# Altium project MC3_r2.PrjPcb (part 8 of 10)

## Sheet PowerSupply.SchDoc
size Letter; Organization: Altium Limited; Address1: L3, 12a Rodborough Rd; Address2: Frenchs Forest; Address3: NSW; Address4: Australia 2086; DocumentNumber: D_6; SheetNumber: 6; SheetTotal: 21
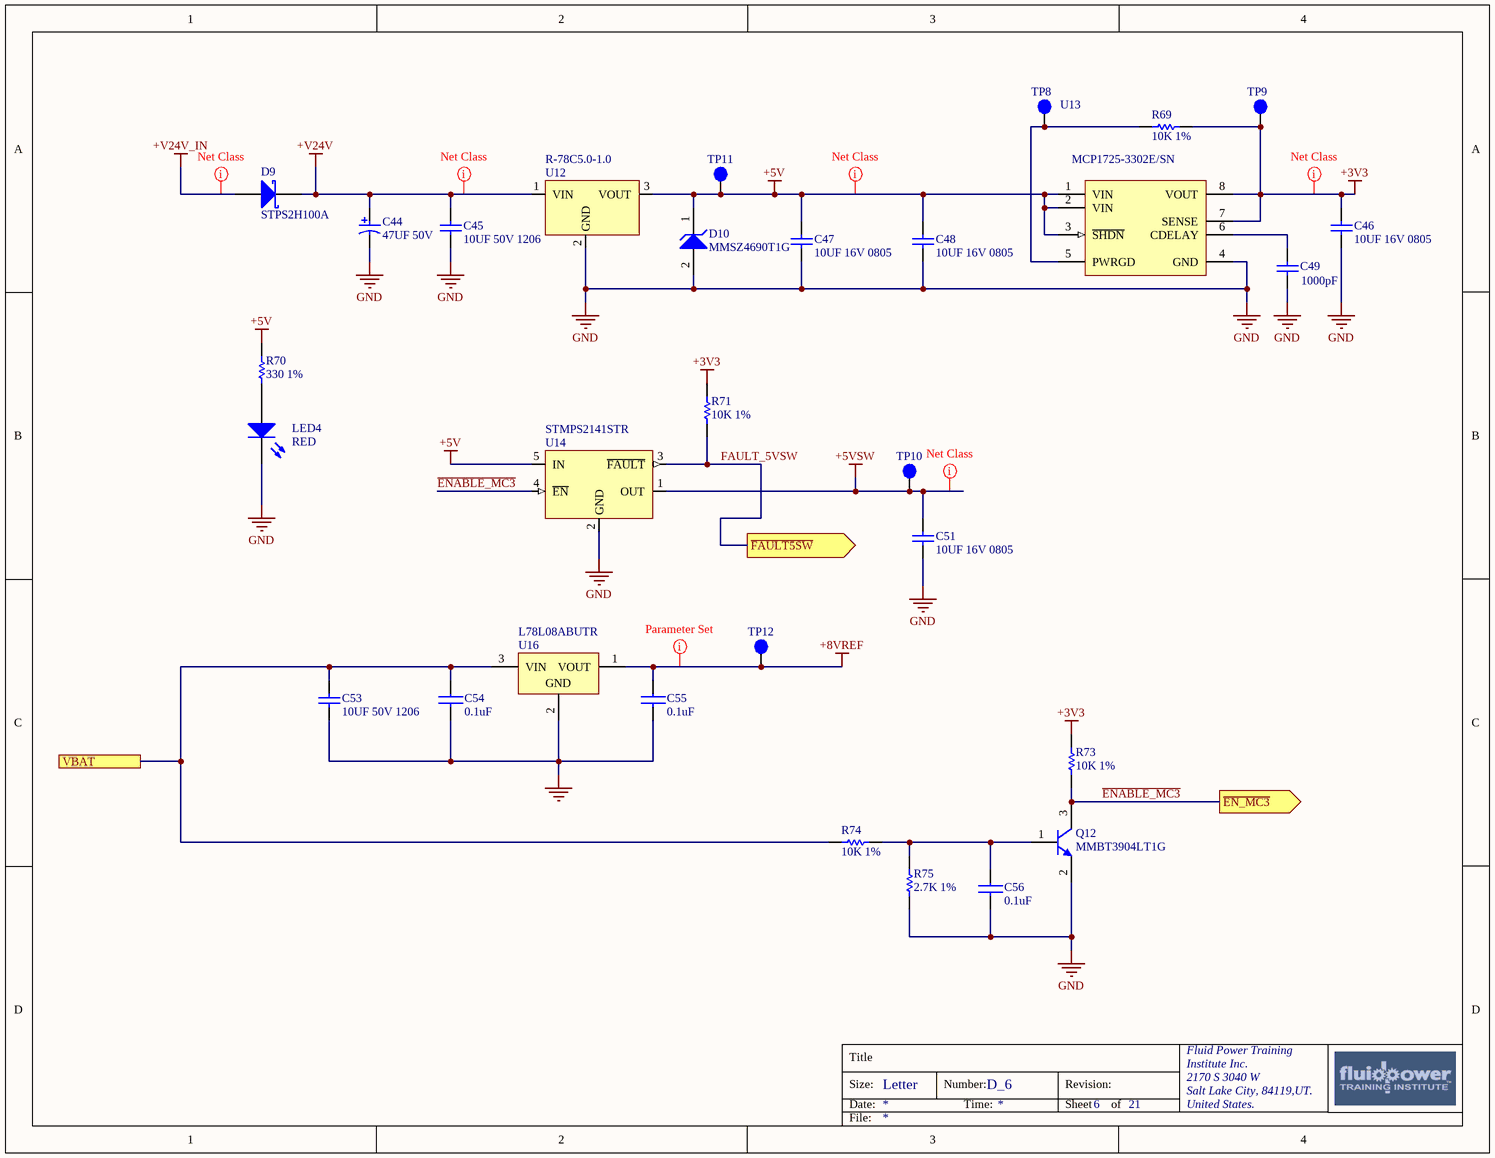
[diagram p14: PowerSupply.SchDoc]

### Parts
C44  47UF 50V  [PNSC-EEE-HA1H470XP-2_V]
C45  10UF 50V 1206  [CAPC3216X180X20ML20]
C46  10UF 16V 0805  [CAPC2012X14M]
C47  10UF 16V 0805  [CAPC2012X14M]
C48  10UF 16V 0805  [CAPC2012X14M]
C49  1000pF  [C0805]
C51  10UF 16V 0805  [CAPC2012X14M]
C53  10UF 50V 1206  [CAPC3216X180X20ML20]
C54  0.1uF  [C0805]
C55  0.1uF  [C0805]
C56  0.1uF  [C0805]
D9  STPS2H100A  [STM-SMA-2_V]
D10  MMSZ4690T1G  [ONSC-SOD-123-2-425-04_V]
LED4  RED  [LED0805]
Q12  MMBT3904LT1G  [ONSC-SOT-23-3-318-08_V]
R69  10K 1%  [R0805]
R70  330 1%  [R0805]
R71  10K 1%  [R0805]
R73  10K 1%  [R0805]
R74  10K 1%  [R0805]
R75  2.7K 1%  [R0805]
TP8  T  [TESTPOINTSMD_1x1MM]  (value not drawn)  (no BOM)
TP9  T  [TESTPOINTSMD_1x1MM]  (value not drawn)  (no BOM)
TP10  T  [TESTPOINTSMD_1x1MM]  (value not drawn)  (no BOM)
TP11  T  [TESTPOINTSMD_1x1MM]  (value not drawn)  (no BOM)
TP12  T  [TESTPOINTSMD_1x1MM]  (value not drawn)  (no BOM)
U12  R-78C5.0-1.0  [SIP3]
U13  MCP1725-3302E/SN  [SOIC-SN8_M]
U14  STMPS2141STR  [SOT95P280X145-5M]
U16  L78L08ABUTR  [SOT-89_L]

### Ports
VBAT, ~{EN_MC3} (out), ~{FAULT5SW} (out)

### Nets
+3V3: C46.2 R69.2 R71.2 R73.2 TP9.1 U13.7(SENSE) U13.8(VOUT)
+5V: C47.2 C48.2 D10.1(K) R70.2 TP11.1 U12.3(VOUT) U13.1(VIN) U13.2(VIN) U13.3(~{SHDN}) U14.5(IN)
+5VSW: C51.2 TP10.1 U14.1(OUT)
+8VREF: C55.1 TP12.1 U16.1(VOUT)
+V24V: C44.1 C45.2 D9.2(K) U12.1(VIN)
+V24V_IN: D9.1(A)
GND: C44.2 C45.1 C46.1 C47.1 C48.1 C49.1 C51.1 C53.1 C54.2 C55.2 C56.2 D10.2(A) LED4.1(K) Q12.2(E) R75.1 U12.2(GND) U13.4(GND) U14.2(GND) U16.2(GND)
~{ENABLE_MC3}: Q12.3(C) R73.1 U14.4(~{EN}) ; port ~{EN_MC3}  [project net nMC3Power]
FAULT_5VSW: R71.1 U14.3(~{FAULT}) ; port ~{FAULT5SW}  [project net nFault5VSW]
VBATT_: C53.2 C54.1 R74.1 U16.3(VIN) ; port VBAT
NetC49_2: C49.2 U13.6(CDELAY)
NetC56_1: C56.1 Q12.1(B) R74.2 R75.2
NetLED4_2: LED4.2(A) R70.1
NetR69_1: R69.1 TP8.1 U13.5(PWRGD)

### Layout directives
net class POWER: +3V3, +5V, +5VSW, +V24V, +V24V_IN
net class VREF: +8VREF

### Notes on the sheet
- Title
- Size:
- Date:
- Letter
- Number:
- Time:
- Revision:
- Sheet
- of
- Fluid Power Training
- Institute Inc.
- 2170 S 3040 W
- Salt Lake City, 84119,UT.
- United States.
- File:

### Library data of the parts
C44 = EEE-HA1H470XP: EEE-HA Series 50 V 47 uF Ø 6.3 x 7.7 mm 105 °C SMT V-Chip Aluminum Electrolytic; Manufacturer: Panasonic; Ripple Current: 63mA; Tolerance: 20%; Life (Hours): 1000Hour; Leakage Current: 23.5uA; Polarity: Polar; Lead Diameter: 0.65mm; Supplier 1: Mouser; Supplier Part Number 1: 667-EEE-HA1H470XP; Manufacturer Part Number: EEE-HA1H470XP; RoHS: Yes; Category: Aluminum Electrolytic Capacitors; Stock 1: 2923; Pricing 1: 1=0.50000, 10=0.34700, 100=0.11500, 900=0.10900, 1800=0.09700, 9900=0.08900 (USD); Mount: Surface Mount,PCB; Case/Package: Radial; Number of Pins: 8; Contact Plating: Tin; Min Operating Temperature: -40°C; Max Operating Temperature: 105°C; Capacitance: 47uF; Voltage Rating (DC): 50V; Packaging: Tape and Reel; Package Quantity: 900; Voltage Rating: 50V; Termination: SMD/SMT; Voltage: 50V; Ripple Current (AC): 63mA; Diameter: 6.3mm; Length: 8mm; Height: 7.7mm; Height - Seated (Max): 0.303inch; Lead Pitch: 1.8mm; Width: 650um; Radiation Hardening: No; REACH SVHC: No SVHC; Lead Free: Lead Free; ComponentLink1URL: https://datasheet.ciiva.com/11777/0900766b8102e3f9-11777524.pdf?src-supplier=RSComponents; ComponentLink1Description: https://datasheet.ciiva.com/11777/0900766b8102e3f9-11777524.pdf?src-supplier=RSComponents; ComponentLink2URL: https://datasheet.ciiva.com/27052/1358776-27052072.pdf?src-supplier=Jameco; ComponentLink2Description: https://datasheet.ciiva.com/27052/1358776-27052072.pdf?src-supplier=Jameco; ComponentLink3URL: https://datasheet.ciiva.com/2983/aba0000ce3-2983989.pdf?src-supplier=Avnet; ComponentLink3Description: https://datasheet.ciiva.com/2983/aba0000ce3-2983989.pdf?src-supplier=Avnet; ComponentLink4URL: https://datasheet.ciiva.com/28691/1446029-28691286.pdf?src-supplier=Element14; ComponentLink4Description: https://datasheet.ciiva.com/28691/1446029-28691286.pdf?src-supplier=Element14; ComponentLink5URL: https://datasheet.ciiva.com/17536/aba0000ce3-17536201.pdf?src-supplier=Avnet+Europe; ComponentLink5Description: https://datasheet.ciiva.com/17536/aba0000ce3-17536201.pdf?src-supplier=Avnet+Europe; ComponentLink6URL: https://datasheet.ciiva.com/46387/1446029-46387354.pdf?src-supplier=Element14; ComponentLink6Description: https://datasheet.ciiva.com/46387/1446029-46387354.pdf?src-supplier=Element14; ComponentLink7URL: https://datasheet.ciiva.com/5949/1446029-5949851.pdf?src-supplier=Farnell; ComponentLink7Description: https://datasheet.ciiva.com/5949/1446029-5949851.pdf?src-supplier=Farnell; ComponentLink8URL: https://datasheet.ciiva.com/11675/aba0000ce3-11675947.pdf?src-supplier=Avnet; ComponentLink8Description: https://datasheet.ciiva.com/11675/aba0000ce3-11675947.pdf?src-supplier=Avnet; ComponentLink9URL: https://datasheet.ciiva.com/43459/1446029-43459867.pdf?src-supplier=Farnell; ComponentLink9Description: https://datasheet.ciiva.com/43459/1446029-43459867.pdf?src-supplier=Farnell; ComponentLink10URL: https://datasheet.ciiva.com/28691/1446029-28691277.pdf?src-supplier=Element14; ComponentLink10Description: https://datasheet.ciiva.com/28691/1446029-28691277.pdf?src-supplier=Element14; ComponentLink11URL: https://datasheet.ciiva.com/14605/70256712-14605119.pdf?src-supplier=Allied+Electronics; ComponentLink11Description: https://datasheet.ciiva.com/14605/70256712-14605119.pdf?src-supplier=Allied+Electronics; ComponentLink12URL: https://datasheet.ciiva.com/16433/aba0000ce3-16433439.pdf?src-supplier=Future+Electronics; ComponentLink12Description: https://datasheet.ciiva.com/16433/aba0000ce3-16433439.pdf?src-supplier=Future+Electronics; ComponentLink13URL: https://datasheet.ciiva.com/30227/33aba0000ce3-30227599.pdf?src-supplier=Onlinecomponents.com; ComponentLink13Description: https://datasheet.ciiva.com/30227/33aba0000ce3-30227599.pdf?src-supplier=Onlinecomponents.com
C45 C53 = C3216X5R1H106K160AB: CAP CER 10UF 50V X5R 1206; Manufacturer: TDK; Dielectric Material: Ceramic; Tolerance: 10%; Supplier 1: Mouser; Supplier Part Number 1: 810-C3216X5R1H106K; Manufacturer Part Number: C3216X5R1H106K160AB; RoHS: Yes; Category: Ceramic Capacitors; Stock 1: 145018; Pricing 1: 1=0.88000, 10=0.73100, 100=0.51800, 500=0.40900, 1000=0.35200, 2000=0.28700 (USD); Mount: Surface Mount; Case/Package: 1206; Weight: 0.000571oz; Case Code (Metric): 3216; Case Code (Imperial): 1206; Min Operating Temperature: -55°C; Max Operating Temperature: 85°C; Packaging: Tape and Reel; Capacitance: 10uF; Voltage Rating (DC): 50V; Dielectric: X5R; Package Quantity: 1; Voltage Rating: 50V; Termination: SMD/SMT; Voltage: 50V; Composition: Ceramic; Length: 3.2mm; Height: 1.6mm; Width: 0.063inch; Thickness: 0.071inch; Depth: 1.6mm; Radiation Hardening: No; REACH SVHC: No SVHC; Lead Free: Lead Free; ComponentLink1URL: https://datasheet.ciiva.com/24216/c3216x5r1h106k160ab-265364-24216574.pdf?src-supplier=Mouser; ComponentLink1Description: https://datasheet.ciiva.com/24216/c3216x5r1h106k160ab-265364-24216574.pdf?src-supplier=Mouser; ComponentLink2URL: https://datasheet.ciiva.com/6285/tdkmlcccaprange-6285895.pdf?src-supplier=Digi-Key; ComponentLink2Description: https://datasheet.ciiva.com/6285/tdkmlcccaprange-6285895.pdf?src-supplier=Digi-Key; ComponentLink3URL: https://datasheet.ciiva.com/24365/1865c3216x5r1h106k160ab-24365495.pdf?src-supplier=Onlinecomponents.com; ComponentLink3Description: https://datasheet.ciiva.com/24365/1865c3216x5r1h106k160ab-24365495.pdf?src-supplier=Onlinecomponents.com; ComponentLink4URL: https://datasheet.ciiva.com/22719/1796654-22719560.pdf?src-supplier=Element14; ComponentLink4Description: https://datasheet.ciiva.com/22719/1796654-22719560.pdf?src-supplier=Element14; ComponentLink5URL: https://datasheet.ciiva.com/28659/mlcc-commercial-general-en-28659437.pdf?src-supplier=Element14; ComponentLink5Description: https://datasheet.ciiva.com/28659/mlcc-commercial-general-en-28659437.pdf?src-supplier=Element14; ComponentLink6URL: https://datasheet.ciiva.com/17487/e412-c-17487294.pdf?src-supplier=Avnet+Europe; ComponentLink6Description: https://datasheet.ciiva.com/17487/e412-c-17487294.pdf?src-supplier=Avnet+Europe; ComponentLink7URL: https://datasheet.ciiva.com/6285/tdkmlcccaprange-6285893.pdf?src-supplier=Digi-Key; ComponentLink7Description: https://datasheet.ciiva.com/6285/tdkmlcccaprange-6285893.pdf?src-supplier=Digi-Key; ComponentLink8URL: https://datasheet.ciiva.com/22725/1913358-22725589.pdf?src-supplier=Element14; ComponentLink8Description: https://datasheet.ciiva.com/22725/1913358-22725589.pdf?src-supplier=Element14; ComponentLink9URL: https://datasheet.ciiva.com/23803/1796654-23803045.pdf?src-supplier=Newark; ComponentLink9Description: https://datasheet.ciiva.com/23803/1796654-23803045.pdf?src-supplier=Newark; ComponentLink10URL: https://datasheet.ciiva.com/28452/1796654-28452010.pdf?src-supplier=Element14; ComponentLink10Description: https://datasheet.ciiva.com/28452/1796654-28452010.pdf?src-supplier=Element14
C46-C48 C51 = GRM21BR61C106KE15L: CAP CER 10UF 16V X5R 0805; Manufacturer: Murata; Material: Ceramic; Tolerance: 10%; Supplier 1: Mouser; Supplier Part Number 1: 81-GRM21BR61C106KE15; Manufacturer Part Number: GRM21BR61C106KE15L; RoHS: Yes; Category: Ceramic Capacitors; Stock 1: 1115526; Pricing 1: 1=0.31000, 10=0.21500, 100=0.12000, 500=0.08600, 1000=0.07500, 3000=0.06200 (USD); Mount: Surface Mount; Case/Package: 0805; Case Code (Imperial): 0805; Case Code (Metric): 2012; Min Operating Temperature: -55°C; Max Operating Temperature: 85°C; Capacitance: 10uF; Packaging: Tape and Reel; Voltage Rating: 16V; Dielectric: X5R; Voltage Rating (DC): 16V; Package Quantity: 1; Termination: SMD/SMT; Voltage: 16V; Length: 2mm; Height: 1.25mm; Width: 1.25mm; Thickness: 0.053inch; Depth: 1.25mm; Radiation Hardening: No; REACH SVHC: No SVHC; Lead Free: Lead Free; ComponentLink1URL: https://datasheet.ciiva.com/2989/product-2989696.pdf?src-supplier=Avnet; ComponentLink1Description: https://datasheet.ciiva.com/2989/product-2989696.pdf?src-supplier=Avnet; ComponentLink2URL: https://datasheet.ciiva.com/3777/1956grm21br61c106ke1523-3777137.pdf?src-supplier=Arrow; ComponentLink2Description: https://datasheet.ciiva.com/3777/1956grm21br61c106ke1523-3777137.pdf?src-supplier=Arrow; ComponentLink3URL: https://datasheet.ciiva.com/7719/1747468-7719090.pdf?src-supplier=Element14; ComponentLink3Description: https://datasheet.ciiva.com/7719/1747468-7719090.pdf?src-supplier=Element14; ComponentLink4URL: https://datasheet.ciiva.com/23628/460993-23628598.pdf?src-supplier=Newark; ComponentLink4Description: https://datasheet.ciiva.com/23628/460993-23628598.pdf?src-supplier=Newark; ComponentLink5URL: https://datasheet.ciiva.com/29202/450891-da-01-de-vs-chip-kond-0805-10-0-uf-10pr-16-0v-x5r-29202696.pdf?src-supplier=Conrad; ComponentLink5Description: https://datasheet.ciiva.com/29202/450891-da-01-de-vs-chip-kond-0805-10-0-uf-10pr-16-0v-x5r-29202696.pdf?src-supplier=Conrad; ComponentLink6URL: https://datasheet.ciiva.com/29199/454607-da-01-en-vs-kondensator-0805-29199611.pdf?src-supplier=Conrad; ComponentLink6Description: https://datasheet.ciiva.com/29199/454607-da-01-en-vs-kondensator-0805-29199611.pdf?src-supplier=Conrad; ComponentLink7URL: https://datasheet.ciiva.com/2989/product-2989697.pdf?src-supplier=Avnet; ComponentLink7Description: https://datasheet.ciiva.com/2989/product-2989697.pdf?src-supplier=Avnet; ComponentLink8URL: https://datasheet.ciiva.com/137/partnumbering-e-01-137917.pdf?src-supplier=Digi-Key; ComponentLink8Description: https://datasheet.ciiva.com/137/partnumbering-e-01-137917.pdf?src-supplier=Digi-Key; ComponentLink9URL: https://datasheet.ciiva.com/137/partnumbering-e-01-137918.pdf?src-supplier=Digi-Key; ComponentLink9Description: https://datasheet.ciiva.com/137/partnumbering-e-01-137918.pdf?src-supplier=Digi-Key; ComponentLink10URL: https://datasheet.ciiva.com/137/partnumbering-e-01-137919.pdf?src-supplier=Digi-Key; ComponentLink10Description: https://datasheet.ciiva.com/137/partnumbering-e-01-137919.pdf?src-supplier=Digi-Key
C49 = C0805C102K1RACTU: MLCC, 1000 pF, - 10%, X7R, 100 V, 0805 [2012 Metric] RoHS Compliant: Yes; Manufacturer: KEMET; Dielectric Material: Ceramic; Capacitance: 1nF; Voltage Rating: 100V; Supplier 1: Mouser; Supplier Part Number 1: 80-C0805C102K1R; Manufacturer Part Number: C0805C102K1RACTU; RoHS: Yes; Category: Ceramic Capacitors; Stock 1: 40129; Pricing 1: 1=0.19000, 10=0.08200, 100=0.05400, 500=0.04300, 1000=0.03600, 4000=0.02000 (USD); Mount: Surface Mount,PCB; Case/Package: 0805; Number of Pins: 2; Case Code (Imperial): 0805; Case Code (Metric): 2012; Min Operating Temperature: -55°C; Max Operating Temperature: 125°C; Tolerance: 10%; Packaging: Tape and Reel; Dielectric: X7R; Voltage Rating (DC): 100V; Package Quantity: 1; Termination: SMD/SMT; Length: 2mm; Height: 0.78mm; Width: 0.049inch; Thickness: 0.035inch; Depth: 1.25mm; Lead Pitch: 0.75mm; Radiation Hardening: No; REACH SVHC: No SVHC; ComponentLink1URL: https://datasheet.ciiva.com/26847/getdatasheetpartid-385636-26847782.pdf?src-supplier=Verical; ComponentLink1Description: https://datasheet.ciiva.com/26847/getdatasheetpartid-385636-26847782.pdf?src-supplier=Verical; ComponentLink2URL: https://datasheet.ciiva.com/5413/kem-c1002-x7r-smd-357932-5413784.pdf?src-supplier=Mouser; ComponentLink2Description: https://datasheet.ciiva.com/5413/kem-c1002-x7r-smd-357932-5413784.pdf?src-supplier=Mouser; Voltage: 100V; ComponentLink3URL: https://datasheet.ciiva.com/14592/70095383-14592824.pdf?src-supplier=Allied+Electronics; ComponentLink3Description: https://datasheet.ciiva.com/14592/70095383-14592824.pdf?src-supplier=Allied+Electronics; ComponentLink4URL: https://datasheet.ciiva.com/7842/kem-c1002-x7r-smd-7842523.pdf?src-supplier=Element14; ComponentLink4Description: https://datasheet.ciiva.com/7842/kem-c1002-x7r-smd-7842523.pdf?src-supplier=Element14; ComponentLink5URL: https://datasheet.ciiva.com/14589/70095383-14589435.pdf?src-supplier=Allied+Electronics; ComponentLink5Description: https://datasheet.ciiva.com/14589/70095383-14589435.pdf?src-supplier=Allied+Electronics; ComponentLink6URL: https://datasheet.ciiva.com/7842/40889-7842157.pdf?src-supplier=Element14; ComponentLink6Description: https://datasheet.ciiva.com/7842/40889-7842157.pdf?src-supplier=Element14; ComponentLink7URL: https://datasheet.ciiva.com/5904/kem-c1002-x7r-smd-5904911.pdf?src-supplier=Farnell; ComponentLink7Description: https://datasheet.ciiva.com/5904/kem-c1002-x7r-smd-5904911.pdf?src-supplier=Farnell; ComponentLink8URL: https://datasheet.ciiva.com/22700/1851736-22700511.pdf?src-supplier=Element14; ComponentLink8Description: https://datasheet.ciiva.com/22700/1851736-22700511.pdf?src-supplier=Element14
C54-C56 = C0805C104K5RACTU: Cap Ceramic 0.1uF 50V X7R 10% SMD 2.0 x 1.2 mm 125 C Paper T/R; Manufacturer: KEMET; Capacitance: 100nF; Voltage: 500V; Manufacturer Part Number: C0805C104K5RACTU; RoHS: Yes; Stock 1: 4177670; Pricing 1: 1=0.17000, 10=0.10400, 100=0.05600, 500=0.03900, 1000=0.03200, 4000=0.02400 (USD); Supplier 1: Mouser; Supplier Part Number 1: 80-C0805C104K5R; Category: Ceramic Capacitors; Mount: Surface Mount,PCB; Case/Package: 0805; Number of Pins: 2; Case Code (Imperial): 0805; Case Code (Metric): 2012; Dielectric Material: Ceramic; Contact Plating: Tin,Matte; Min Operating Temperature: -55°C; Max Operating Temperature: 125°C; Voltage Rating: 50V; Tolerance: 10%; Packaging: Tape and Reel; Dielectric: X7R; Package Quantity: 4000; Voltage Rating (DC): 50V; Termination: SMD/SMT; Length: 2mm; Height: 0.9mm; Width: 1.2mm; Depth: 1.25mm; Thickness: 0.035inch; Lead Pitch: 0.75mm; Radiation Hardening: No; REACH SVHC: No SVHC; ComponentLink1URL: https://datasheet.ciiva.com/14589/70095383-14589048.pdf?src-supplier=Allied+Electronics; ComponentLink1Description: https://datasheet.ciiva.com/14589/70095383-14589048.pdf?src-supplier=Allied+Electronics; ComponentLink2URL: https://datasheet.ciiva.com/28682/1851736-28682232.pdf?src-supplier=Element14; ComponentLink2Description: https://datasheet.ciiva.com/28682/1851736-28682232.pdf?src-supplier=Element14; ComponentLink3URL: https://datasheet.ciiva.com/32431/slceramic-chip-condensers-e-32431755.pdf?src-supplier=Distrelec; ComponentLink3Description: https://datasheet.ciiva.com/32431/slceramic-chip-condensers-e-32431755.pdf?src-supplier=Distrelec; ComponentLink4URL: https://datasheet.ciiva.com/18410/70095383-18410815.pdf?src-supplier=Allied+Electronics; ComponentLink4Description: https://datasheet.ciiva.com/18410/70095383-18410815.pdf?src-supplier=Allied+Electronics
D9 = STPS2H100A: DIODE SCHOTTKY 100V 2A SMA; Manufacturer: STMicroelectronics; Peak Reverse Current: 1uA; Peak Non-Repetitive Surge Current: 75A; Element Configuration: Single; Forward Voltage: 650mV; Polarity: Standard; Supplier 1: Mouser; Supplier Part Number 1: 511-STPS2H100A; Manufacturer Part Number: STPS2H100A; RoHS: Yes; Category: Schottky Diodes; Stock 1: 26018; Pricing 1: 1=0.45000, 10=0.36600, 100=0.22300, 1000=0.17300, 5000=0.14700, 10000=0.13700 (USD); Mount: Surface Mount; Case/Package: SMA; Number of Pins: 2; Weight: 0.01lb; Contact Plating: Tin,Matte; Min Operating Temperature: -65°C; Max Operating Temperature: 175°C; Forward Current: 2A; Max Repetitive Reverse Voltage (Vrrm): 100V; Package Quantity: 5000; Packaging: Tape and Reel; Average Rectified Current: 2A; Max Forward Surge Current (Ifsm): 75A; Max Reverse Voltage (DC): 100V; Max Surge Current: 75A; Max Reverse Leakage Current: 1uA; Voltage Rating (DC): 100V; Output Current: 2A; Current Rating: 2A; Length: 4.6mm; Height: 2.03mm; Width: 2.95mm; Radiation Hardening: No; REACH SVHC: No SVHC; Lead Free: Lead Free; ComponentLink1URL: https://datasheet.ciiva.com/14178/cd00001548-14178421.pdf?src-supplier=Distrelec; ComponentLink1Description: https://datasheet.ciiva.com/14178/cd00001548-14178421.pdf?src-supplier=Distrelec; ComponentLink2URL: https://datasheet.ciiva.com/26788/stps2h100a-26788632.pdf?src-supplier=IIIC; ComponentLink2Description: https://datasheet.ciiva.com/26788/stps2h100a-26788632.pdf?src-supplier=IIIC; ComponentLink3URL: https://datasheet.ciiva.com/916/cd00001548-916177.pdf?src-supplier=Digi-Key; ComponentLink3Description: https://datasheet.ciiva.com/916/cd00001548-916177.pdf?src-supplier=Digi-Key; ComponentLink4URL: https://datasheet.ciiva.com/916/cd00001548-916178.pdf?src-supplier=Digi-Key; ComponentLink4Description: https://datasheet.ciiva.com/916/cd00001548-916178.pdf?src-supplier=Digi-Key; ComponentLink5URL: https://datasheet.ciiva.com/916/cd00001548-916179.pdf?src-supplier=Digi-Key; ComponentLink5Description: https://datasheet.ciiva.com/916/cd00001548-916179.pdf?src-supplier=Digi-Key; ComponentLink6URL: https://datasheet.ciiva.com/7963/1724011-7963926.pdf?src-supplier=Element14; ComponentLink6Description: https://datasheet.ciiva.com/7963/1724011-7963926.pdf?src-supplier=Element14; ComponentLink7URL: https://datasheet.ciiva.com/7963/1724011-7963927.pdf?src-supplier=Element14; ComponentLink7Description: https://datasheet.ciiva.com/7963/1724011-7963927.pdf?src-supplier=Element14; ComponentLink8URL: https://datasheet.ciiva.com/16394/cd00001548-16394856.pdf?src-supplier=Future+Electronics; ComponentLink8Description: https://datasheet.ciiva.com/16394/cd00001548-16394856.pdf?src-supplier=Future+Electronics
D10 = MMSZ4690T1G: DIODE ZENER 5.6V 500MW SOD123; Manufacturer: ON Semiconductor; Material: Plastic; Tolerance: 5%; Max Reverse Leakage Current: 10uA; Element Configuration: Single; Forward Voltage: 900mV; Zener Current: 50uA; Breakdown Voltage: 5.88V; ESD Protection: Yes; Supplier 1: Mouser; Supplier Part Number 1: 863-MMSZ4690T1G; Manufacturer Part Number: MMSZ4690T1G; RoHS: Yes; Category: Zener Diodes; Stock 1: 89928; Pricing 1: 1=0.20000, 10=0.18900, 100=0.06600, 1000=0.04400, 3000=0.03300, 9000=0.02900 (USD); Case/Package: SOD-123-2; Number of Pins: 2; Contact Plating: Tin,Matte; Min Operating Temperature: -55°C; Max Operating Temperature: 150°C; Max Power Dissipation: 500mW; Packaging: Tape and Reel; Zener Voltage: 5.6V; Package Quantity: 1; Voltage Tolerance: 5%; Power Dissipation: 500mW; Test Current: 50uA; Working Voltage: 5.6V; Peak Reverse Current: 50uA; Voltage Rating (DC): 5.6V; Power Rating: 500mW; Length: 0.111inch; Height: 0.053inch; Width: 0.071inch; Radiation Hardening: No; Lead Free: Lead Free; REACH SVHC: No SVHC; ComponentLink1URL: https://datasheet.ciiva.com/894/mmsz4678t1-d-894880.pdf?src-supplier=Avnet; ComponentLink1Description: https://datasheet.ciiva.com/894/mmsz4678t1-d-894880.pdf?src-supplier=Avnet; ComponentLink2URL: https://datasheet.ciiva.com/27056/2011678-27056166.pdf?src-supplier=Jameco; ComponentLink2Description: https://datasheet.ciiva.com/27056/2011678-27056166.pdf?src-supplier=Jameco; ComponentLink3URL: https://datasheet.ciiva.com/26092/mmsz4678t1-d-26092599.pdf?src-supplier=Avnet+Europe; ComponentLink3Description: https://datasheet.ciiva.com/26092/mmsz4678t1-d-26092599.pdf?src-supplier=Avnet+Europe; ComponentLink4URL: https://datasheet.ciiva.com/894/mmsz4678t1-d-894968.pdf?src-supplier=Digi-Key; ComponentLink4Description: https://datasheet.ciiva.com/894/mmsz4678t1-d-894968.pdf?src-supplier=Digi-Key; ComponentLink5URL: https://datasheet.ciiva.com/894/mmsz4678t1-d-894969.pdf?src-supplier=Digi-Key; ComponentLink5Description: https://datasheet.ciiva.com/894/mmsz4678t1-d-894969.pdf?src-supplier=Digi-Key; ComponentLink6URL: https://datasheet.ciiva.com/894/mmsz4678t1-d-894970.pdf?src-supplier=Digi-Key; ComponentLink6Description: https://datasheet.ciiva.com/894/mmsz4678t1-d-894970.pdf?src-supplier=Digi-Key; ComponentLink7URL: https://datasheet.ciiva.com/22747/1796559-22747883.pdf?src-supplier=Element14; ComponentLink7Description: https://datasheet.ciiva.com/22747/1796559-22747883.pdf?src-supplier=Element14; ComponentLink8URL: https://datasheet.ciiva.com/8346/mmsz4678t1-d-8346092.pdf?src-supplier=Avnet; ComponentLink8Description: https://datasheet.ciiva.com/8346/mmsz4678t1-d-8346092.pdf?src-supplier=Avnet; ComponentLink9URL: https://datasheet.ciiva.com/16473/mmsz4678t1-d-16473372.pdf?src-supplier=Avnet+Asia; ComponentLink9Description: https://datasheet.ciiva.com/16473/mmsz4678t1-d-16473372.pdf?src-supplier=Avnet+Asia; ComponentLink10URL: https://datasheet.ciiva.com/18435/70099545-18435389.pdf?src-supplier=Allied+Electronics; ComponentLink10Description: https://datasheet.ciiva.com/18435/70099545-18435389.pdf?src-supplier=Allied+Electronics; ComponentLink11URL: https://datasheet.ciiva.com/16205/mmsz4678t1-d-16205902.pdf?src-supplier=Future+Electronics; ComponentLink11Description: https://datasheet.ciiva.com/16205/mmsz4678t1-d-16205902.pdf?src-supplier=Future+Electronics
LED4 = 150080RS75000: LED RED CLEAR 0805 SMD; Manufacturer: Wurth Electronics; Lens Style: Clear,Rectangular; Forward Voltage: 2V; Viewing Angle: 140°; Luminous Intensity: 150mcd; Forward Current: 30mA; Test Current: 20mA; Dominant Wavelength: 625nm; Supplier 1: Mouser; Supplier Part Number 1: 710-150080RS75000; Manufacturer Part Number: 150080RS75000; RoHS: Yes; Category: LEDs; Stock 1: 2434; Pricing 1: 1=0.18000, 10=0.17500, 25=0.17400, 50=0.16200, 100=0.13900, 250=0.12300 (USD); Mount: Surface Mount; Case/Package: 0805; Color: Red; Case Code (Metric): 2012; Case Code (Imperial): 0805; Min Operating Temperature: -40°C; Max Operating Temperature: 85°C; Packaging: Tape and Reel; Package Quantity: 4000; Wavelength: 625nm; Length: 2mm; Height: 0.7mm; Width: 1.25mm; REACH SVHC: Unknown; ComponentLink1URL: https://datasheet.ciiva.com/22656/150080rs75000-22656961.pdf?src-supplier=Element14; ComponentLink1Description: https://datasheet.ciiva.com/22656/150080rs75000-22656961.pdf?src-supplier=Element14; ComponentLink2URL: https://datasheet.ciiva.com/29279/759435-da-01-en-chipled-0805-w-kl-rot-150080rs75000-29279032.pdf?src-supplier=Conrad; ComponentLink2Description: https://datasheet.ciiva.com/29279/759435-da-01-en-chipled-0805-w-kl-rot-150080rs75000-29279032.pdf?src-supplier=Conrad
Q12 = MMBT3904LT1G: ON Semi MMBT3904LT1G NPN Bipolar Transistor, 0.2 A, 40 V, 3-Pin SOT-23; Manufacturer: ON Semiconductor; Collector Emitter Breakdown Voltage: 40V; Max Power Dissipation: 300mW; Max Collector Current: 200mA; Collector Base Voltage (VCBO): 60V; Emitter Base Voltage (VEBO): 6V; Element Configuration: Single; Transition Frequency: 300MHz; Collector Emitter Saturation Voltage: 300mV; hFE Min: 100; Number of Elements: 1; Type: General Purpose; Supplier 1: Mouser; Supplier Part Number 1: 863-MMBT3904LT1G; Manufacturer Part Number: MMBT3904LT1G; RoHS: Yes; Category: BJTs; Stock 1: 753014; Pricing 1: 1=0.12000, 10=0.10900, 100=0.03800, 1000=0.02500, 3000=0.01900, 9000=0.01700 (USD); Case/Package: SOT-23-3; Number of Pins: 3; Contact Plating: Tin,Matte; Min Operating Temperature: -55°C; Max Operating Temperature: 150°C; Packaging: Tape and Reel; Polarity: NPN; Collector Emitter Voltage (VCEO): 40V; Package Quantity: 1; Gain Bandwidth Product: 300MHz; Power Dissipation: 300mW; Max Breakdown Voltage: 40V; Voltage Rating (DC): 40V; Current Rating: 200mA; Frequency: 300MHz; Max Frequency: 300MHz; Length: 2.9mm; Height: 0.94mm; Width: 1.3mm; Radiation Hardening: No; Lead Free: Lead Free; REACH SVHC: No SVHC; ComponentLink1URL: https://datasheet.ciiva.com/16199/mmbt3904lt1-d-16199009.pdf?src-supplier=Future+Electronics; ComponentLink1Description: https://datasheet.ciiva.com/16199/mmbt3904lt1-d-16199009.pdf?src-supplier=Future+Electronics; ComponentLink2URL: https://datasheet.ciiva.com/4723/mmbt3904lt1-d-113169-4723050.pdf?src-supplier=Mouser; ComponentLink2Description: https://datasheet.ciiva.com/4723/mmbt3904lt1-d-113169-4723050.pdf?src-supplier=Mouser; ComponentLink3URL: https://datasheet.ciiva.com/15138/getdatasheetpartid-53263-15138779.pdf?src-supplier=Verical; ComponentLink3Description: https://datasheet.ciiva.com/15138/getdatasheetpartid-53263-15138779.pdf?src-supplier=Verical; ComponentLink4URL: https://datasheet.ciiva.com/976/mmbt3904lt1-d-976362.pdf?src-supplier=Digi-Key; ComponentLink4Description: https://datasheet.ciiva.com/976/mmbt3904lt1-d-976362.pdf?src-supplier=Digi-Key; ComponentLink5URL: https://datasheet.ciiva.com/16478/mmbt3904lt1-d-16478538.pdf?src-supplier=Avnet+Asia; ComponentLink5Description: https://datasheet.ciiva.com/16478/mmbt3904lt1-d-16478538.pdf?src-supplier=Avnet+Asia; ComponentLink6URL: https://datasheet.ciiva.com/976/mmbt3904lt1-d-976363.pdf?src-supplier=Digi-Key; ComponentLink6Description: https://datasheet.ciiva.com/976/mmbt3904lt1-d-976363.pdf?src-supplier=Digi-Key; ComponentLink7URL: https://datasheet.ciiva.com/11199/mmbt3904lt1-d-11199003.pdf?src-supplier=Avnet; ComponentLink7Description: https://datasheet.ciiva.com/11199/mmbt3904lt1-d-11199003.pdf?src-supplier=Avnet; ComponentLink8URL: https://datasheet.ciiva.com/976/mmbt3904lt1-d-976364.pdf?src-supplier=Digi-Key; ComponentLink8Description: https://datasheet.ciiva.com/976/mmbt3904lt1-d-976364.pdf?src-supplier=Digi-Key; ComponentLink9URL: https://datasheet.ciiva.com/14546/70099530-14546188.pdf?src-supplier=Allied+Electronics; ComponentLink9Description: https://datasheet.ciiva.com/14546/70099530-14546188.pdf?src-supplier=Allied+Electronics; ComponentLink10URL: https://datasheet.ciiva.com/7972/1708269-7972381.pdf?src-supplier=Element14; ComponentLink10Description: https://datasheet.ciiva.com/7972/1708269-7972381.pdf?src-supplier=Element14; ComponentLink11URL: https://datasheet.ciiva.com/22664/1708269-22664159.pdf?src-supplier=Element14; ComponentLink11Description: https://datasheet.ciiva.com/22664/1708269-22664159.pdf?src-supplier=Element14
R69 R71 R73 R74 = CRCW080510K0FKEA: VISHAY - CRCW080510K0FKEA - SMD Chip Resistor, 0805 [2012 Metric], 10 kohm, CRCW e3 Series, 150 V, Thick Film, 125 mW; Resistance: 10kR; Temperature Coefficient: 100ppm/°C; Power Rating: 125mW; Voltage Rating: 150V; Supplier 1: Mouser; Manufacturer: Vishay; Manufacturer Part Number: CRCW080510K0FKEA; RoHS: Yes; Stock 1: 1138857; Pricing 1: 1=0.10000, 10=0.06200, 100=0.02500, 1000=0.01000, 5000=0.00700, 10000=0.00600 (USD); ComponentLink1URL: https://datasheet.ciiva.com/11808/0900766b80d98b26-11808216.pdf?src-supplier=RSComponents; ComponentLink1Description: https://datasheet.ciiva.com/11808/0900766b80d98b26-11808216.pdf?src-supplier=RSComponents; ComponentLink2URL: https://datasheet.ciiva.com/5547/dcrcwe3-109170-5547559.pdf?src-supplier=Mouser; ComponentLink2Description: https://datasheet.ciiva.com/5547/dcrcwe3-109170-5547559.pdf?src-supplier=Mouser; Supplier Part Number 1: 71-CRCW0805-10K-E3; Category: Chip SMD Resistors; Case/Package: 0805; Weight: 0.000194oz; Case Code (Imperial): 0805; Case Code (Metric): 2012; Contact Plating: Tin; Min Operating Temperature: -55°C; Max Operating Temperature: 155°C; Tolerance: 1%; Packaging: Tape and Reel; Composition: Thick Film; Termination: SMD/SMT; Voltage Rating (DC): 150V; Package Quantity: 5000; Military Standard: Not; Length: 2mm; Height: 0.45mm; Width: 1.25mm; Depth: 1.25mm; Radiation Hardening: No; Lead Free: Lead Free; REACH SVHC: Unknown; ComponentLink3URL: https://datasheet.ciiva.com/16719/70201119-16719082.pdf?src-supplier=Allied+Electronics; ComponentLink3Description: https://datasheet.ciiva.com/16719/70201119-16719082.pdf?src-supplier=Allied+Electronics; ComponentLink4URL: https://datasheet.ciiva.com/16883/dcrcwe3-16883708.pdf?src-supplier=Avnet+Europe; ComponentLink4Description: https://datasheet.ciiva.com/16883/dcrcwe3-16883708.pdf?src-supplier=Avnet+Europe; ComponentLink5URL: https://datasheet.ciiva.com/8337/dcrcwe3-8337773.pdf?src-supplier=Avnet; ComponentLink5Description: https://datasheet.ciiva.com/8337/dcrcwe3-8337773.pdf?src-supplier=Avnet; ComponentLink6URL: https://datasheet.ciiva.com/46394/1720486-46394381.pdf?src-supplier=Element14; ComponentLink6Description: https://datasheet.ciiva.com/46394/1720486-46394381.pdf?src-supplier=Element14; ComponentLink7URL: https://datasheet.ciiva.com/16199/dcrcwe3-16199086.pdf?src-supplier=Future+Electronics; ComponentLink7Description: https://datasheet.ciiva.com/16199/dcrcwe3-16199086.pdf?src-supplier=Future+Electronics; ComponentLink8URL: https://datasheet.ciiva.com/16514/dcrcwe3-16514907.pdf?src-supplier=Avnet+Asia; ComponentLink8Description: https://datasheet.ciiva.com/16514/dcrcwe3-16514907.pdf?src-supplier=Avnet+Asia; ComponentLink9URL: https://datasheet.ciiva.com/16755/70201119-16755389.pdf?src-supplier=Allied+Electronics; ComponentLink9Description: https://datasheet.ciiva.com/16755/70201119-16755389.pdf?src-supplier=Allied+Electronics; ComponentLink10URL: https://datasheet.ciiva.com/8337/dcrcwe3-8337774.pdf?src-supplier=Avnet; ComponentLink10Description: https://datasheet.ciiva.com/8337/dcrcwe3-8337774.pdf?src-supplier=Avnet
R70 = ERJ-6ENF3300V: RES SMD 330 OHM 1% 1/8W 0805; Manufacturer: Panasonic; Resistance: 330R; Power Rating: 125mW; Temperature Coefficient: 100ppm/°C; Voltage Rating: 150V; Supplier 1: Mouser; Manufacturer Part Number: ERJ-6ENF3300V; RoHS: Yes; Category: Chip SMD Resistors; Stock 1: 121287; Pricing 1: 1=0.10000, 10=0.08900, 100=0.03500, 500=0.03500, 1000=0.01900, 5000=0.01700 (USD); Mount: Surface Mount; Case/Package: 0805; Contact Plating: Tin; Min Operating Temperature: -55°C; Max Operating Temperature: 155°C; Composition: Thick Film; Termination: SMD/SMT; Tolerance: 1%; Length: 2mm; ComponentLink1URL: https://datasheet.ciiva.com/11821/0900766b80f80784-11821635.pdf?src-supplier=RSComponents; ComponentLink1Description: https://datasheet.ciiva.com/11821/0900766b80f80784-11821635.pdf?src-supplier=RSComponents; ComponentLink2URL: https://datasheet.ciiva.com/30131/aoa0000ce2-30131349.pdf?src-supplier=Onlinecomponents.com; ComponentLink2Description: https://datasheet.ciiva.com/30131/aoa0000ce2-30131349.pdf?src-supplier=Onlinecomponents.com; Supplier Part Number 1: 667-ERJ-6ENF3300V; Number of Pins: 2; Case Code (Imperial): 0805; Case Code (Metric): 2012; Packaging: Tape and Reel; Number of Terminations: 2; Max Power Dissipation: 125mW; Package Quantity: 1; Military Standard: Not; Features: Automotive AEC-Q200; Height: 0.6mm; Width: 1.2mm; Depth: 1.25mm; Radiation Hardening: No; REACH SVHC: No SVHC; ComponentLink3URL: https://datasheet.ciiva.com/24025/aoa0000ce2-24025991.pdf?src-supplier=Mouser; ComponentLink3Description: https://datasheet.ciiva.com/24025/aoa0000ce2-24025991.pdf?src-supplier=Mouser; ComponentLink4URL: https://datasheet.ciiva.com/17206/aoa0000ce2-17206152.pdf?src-supplier=Avnet+Europe; ComponentLink4Description: https://datasheet.ciiva.com/17206/aoa0000ce2-17206152.pdf?src-supplier=Avnet+Europe; ComponentLink5URL: https://datasheet.ciiva.com/46436/1678782-46436633.pdf?src-supplier=Element14; ComponentLink5Description: https://datasheet.ciiva.com/46436/1678782-46436633.pdf?src-supplier=Element14; ComponentLink6URL: https://datasheet.ciiva.com/46436/1678782-46436634.pdf?src-supplier=Element14; ComponentLink6Description: https://datasheet.ciiva.com/46436/1678782-46436634.pdf?src-supplier=Element14; ComponentLink7URL: https://datasheet.ciiva.com/16760/70260748-16760668.pdf?src-supplier=Allied+Electronics; ComponentLink7Description: https://datasheet.ciiva.com/16760/70260748-16760668.pdf?src-supplier=Allied+Electronics; ComponentLink8URL: https://datasheet.ciiva.com/16780/70260748-16780764.pdf?src-supplier=Allied+Electronics; ComponentLink8Description: https://datasheet.ciiva.com/16780/70260748-16780764.pdf?src-supplier=Allied+Electronics; ComponentLink9URL: https://datasheet.ciiva.com/22684/1678782-22684798.pdf?src-supplier=Element14; ComponentLink9Description: https://datasheet.ciiva.com/22684/1678782-22684798.pdf?src-supplier=Element14; ComponentLink10URL: https://datasheet.ciiva.com/28590/1678782-28590783.pdf?src-supplier=Element14; ComponentLink10Description: https://datasheet.ciiva.com/28590/1678782-28590783.pdf?src-supplier=Element14
R75 = AC0805FR-072K7L: RES SMD 2.7K OHM 1% 1/8W 0805; Manufacturer: Yageo; Resistance: 2.7kR; Temperature Coefficient: 100ppm/°C; Power Rating: 125mW; Voltage Rating: 150V; Supplier 1: Mouser; Supplier Part Number 1: 603-AC0805FR-072K7L; Manufacturer Part Number: AC0805FR-072K7L; RoHS: Yes; Category: Chip SMD Resistors; Stock 1: 3900; Pricing 1: 1=0.16000, 10=0.03700, 100=0.01300, 1000=0.01000, 5000=0.00600, 10000=0.00600 (USD); Case/Package: 0805; Case Code (Metric): 2012; Case Code (Imperial): 0805; Min Operating Temperature: -55°C; Max Operating Temperature: 155°C; Packaging: Tape and Reel; Tolerance: 1%; Composition: Thick Film; Termination: SMD/SMT; Number of Terminations: 2; Max Power Dissipation: 125mW; Features: Moisture Resistant,Automotive AEC-Q200; Length: 0.079inch; Height: 0.024inch; Width: 0.049inch; Lead Free: Lead Free; ComponentLink1URL: https://datasheet.ciiva.com/12656/pyu-ac-51-rohs-l-2-12656732.pdf?src-supplier=Mouser; ComponentLink1Description: https://datasheet.ciiva.com/12656/pyu-ac-51-rohs-l-2-12656732.pdf?src-supplier=Mouser
TP8-TP12 = TestPoint_SMD_1x1: SMD Test Point
U12 = R-78C5.0-1.0: DC DC CONVERTER 5V 5W; Manufacturer: Recom; Output Current: 1A; Efficiency: 93%; Min Input Voltage (DC): 8V; Max Input Voltage (DC): 42V; Number of Outputs: 1; Supplier 1: Mouser; Supplier Part Number 1: 919-R-78C5.0-1.0; Manufacturer Part Number: R-78C5.0-1.0; RoHS: Yes; Category: Board Mount Modules; Stock 1: 953; Pricing 1: 1=8.81000, 10=8.68000, 25=8.28000, 50=8.28000, 100=7.48000, 250=7.34000 (USD); Mount: Through Hole,PCB; Case/Package: SIP; Number of Pins: 3; Weight: 2g; Min Operating Temperature: -40°C; Max Operating Temperature: 85°C; Max Output Current: 1A; Output Voltage: 5V; Package Quantity: 42; Packaging: Rail/Tube; Power Rating: 5W; Nominal Output Voltage: 5V; Max Input Voltage: 42V; Min Input Voltage: 8V; Voltage - Output 1: 5V; Current - Output 1: 1A; Output Power: 5W; Max Output Power: 5W; Max Power Dissipation: 5W; Max Output Voltage: 5V; Features: OTP,SCP; Length: 11.6mm; Height: 10.4mm; Width: 8.5mm; Depth: 11.6mm; REACH SVHC: No SVHC; Lead Free: Lead Free; ComponentLink1URL: https://datasheet.ciiva.com/2374/r-78cxx-1-0-2374149.pdf?src-supplier=Digi-Key; ComponentLink1Description: https://datasheet.ciiva.com/2374/r-78cxx-1-0-2374149.pdf?src-supplier=Digi-Key; ComponentLink2URL: https://datasheet.ciiva.com/4643/r-78cxx-1-0-1939-4643610.pdf?src-supplier=Mouser; ComponentLink2Description: https://datasheet.ciiva.com/4643/r-78cxx-1-0-1939-4643610.pdf?src-supplier=Mouser; ComponentLink3URL: https://datasheet.ciiva.com/29344/157764-da-en-01-29344428.pdf?src-supplier=Rapid+Electronics; ComponentLink3Description: https://datasheet.ciiva.com/29344/157764-da-en-01-29344428.pdf?src-supplier=Rapid+Electronics; ComponentLink4URL: https://datasheet.ciiva.com/7618/1425292-7618510.pdf?src-supplier=Element14; ComponentLink4Description: https://datasheet.ciiva.com/7618/1425292-7618510.pdf?src-supplier=Element14
U13 = MCP1725-3302E/SN: IC REG LINEAR 3.3V 500MA 8SOIC; Manufacturer: Microchip; Number of Outputs: 1; Min Input Voltage: 2.3V; Max Input Voltage: 6V; Dropout Voltage: 210mV; Nominal Supply Current: 120uA; Quiescent Current: 220uA; Polarity: Positive; Accuracy: 2%; Output Type: Fixed; Sensing Method: Resistive; Supplier 1: Mouser; Supplier Part Number 1: 579-MCP1725-3302E/SN; Manufacturer Part Number: MCP1725-3302E/SN; RoHS: Yes; Category: Voltage Regulators - Linear; Stock 1: 1446; Pricing 1: 1=0.51000, 10=0.51000, 25=0.43000, 100=0.39000, 250=0.39000, 500=0.39000 (USD); Mount: Surface Mount; Case/Package: SOIC; Number of Pins: 8; Min Operating Temperature: -40°C; Max Operating Temperature: 125°C; Max Output Current: 500mA; Output Voltage: 3.3V; Output Current: 500mA; Packaging: Rail/Tube; Package Quantity: 100; Input Bias Current: 120uA; Min Output Voltage: 3.3V; Output Voltage Accuracy: 2%; Nominal Output Voltage: 3.3V; Length: 4.9mm; Height: 1.25mm; Width: 3.9mm; Radiation Hardening: No; REACH SVHC: No SVHC; Lead Free: Lead Free; ComponentLink1URL: https://datasheet.ciiva.com/23604/22026a-23604365.pdf?src-supplier=Newark; ComponentLink1Description: https://datasheet.ciiva.com/23604/22026a-23604365.pdf?src-supplier=Newark; ComponentLink2URL: https://datasheet.ciiva.com/8041/808903-8041399.pdf?src-supplier=Element14; ComponentLink2Description: https://datasheet.ciiva.com/8041/808903-8041399.pdf?src-supplier=Element14; ComponentLink3URL: https://datasheet.ciiva.com/16293/filehandler-aspxddocname-en520352-16293417.pdf?src-supplier=Future+Electronics; ComponentLink3Description: https://datasheet.ciiva.com/16293/filehandler-aspxddocname-en520352-16293417.pdf?src-supplier=Future+Electronics; ComponentLink4URL: https://datasheet.ciiva.com/15200/getdatasheetpartid-571495-15200267.pdf?src-supplier=Verical; ComponentLink4Description: https://datasheet.ciiva.com/15200/getdatasheetpartid-571495-15200267.pdf?src-supplier=Verical; ComponentLink5URL: https://datasheet.ciiva.com/2040/22026b-2040972.pdf?src-supplier=Digi-Key; ComponentLink5Description: https://datasheet.ciiva.com/2040/22026b-2040972.pdf?src-supplier=Digi-Key; ComponentLink6URL: https://datasheet.ciiva.com/8239/jp520352-8239277.pdf?src-supplier=Avnet; ComponentLink6Description: https://datasheet.ciiva.com/8239/jp520352-8239277.pdf?src-supplier=Avnet; ComponentLink7URL: https://datasheet.ciiva.com/14150/mcp1725-eng-tds-14150077.pdf?src-supplier=Distrelec; ComponentLink7Description: https://datasheet.ciiva.com/14150/mcp1725-eng-tds-14150077.pdf?src-supplier=Distrelec
U14 = STMPS2141STR: IC PWR SWITCH 1CH 500MA SOT23-5; Manufacturer: STMicroelectronics; Nominal Supply Current: 40uA; Max Power Dissipation: 32.5mW; Number of Outputs: 1; Max Input Voltage: 5.5V; Min Input Voltage: 2.7V; Output Current: 0pA; On-State Resistance: 120mR; Turn-On Delay Time: 5ms; Turn-Off Delay Time: 10ms; Interface: On/Off; Fault Protection: Over Temperature,Reverse Current; Output Configuration: High Side; Supplier 1: Mouser; Supplier Part Number 1: 511-STMPS2141STR; Manufacturer Part Number: STMPS2141STR; RoHS: Yes; Category: Hot Swap Controllers; Stock 1: 7375; Pricing 1: 1=0.58000, 10=0.48800, 100=0.29800, 1000=0.23000, 3000=0.19600, 9000=0.18300 (USD); Mount: Surface Mount; Case/Package: SOT-23-5; Number of Pins: 5; Min Operating Temperature: -40°C; Max Operating Temperature: 85°C; Packaging: Tape and Reel; Package Quantity: 3000; Current Rating: 500mA; Max Supply Current: 40uA; Power Dissipation: 32.5mW; Operating Supply Voltage: 5.5V; Max Output Current: 500mA; Number of Inputs: 1; Voltage: 5.5V; Current: 500mA; Length: 3mm; Height: 1.3mm; Width: 1.75mm; Radiation Hardening: No; Lead Free: Lead Free; ComponentLink1URL: https://datasheet.ciiva.com/15108/getdatasheetpartid-160072-15108990.pdf?src-supplier=Verical; ComponentLink1Description: https://datasheet.ciiva.com/15108/getdatasheetpartid-160072-15108990.pdf?src-supplier=Verical; ComponentLink2URL: https://datasheet.ciiva.com/4923/cd00167470-4923447.pdf?src-supplier=Mouser; ComponentLink2Description: https://datasheet.ciiva.com/4923/cd00167470-4923447.pdf?src-supplier=Mouser; ComponentLink3URL: https://datasheet.ciiva.com/1962/cd00167470-1962472.pdf?src-supplier=Digi-Key; ComponentLink3Description: https://datasheet.ciiva.com/1962/cd00167470-1962472.pdf?src-supplier=Digi-Key; ComponentLink4URL: https://datasheet.ciiva.com/1962/cd00167470-1962473.pdf?src-supplier=Digi-Key; ComponentLink4Description: https://datasheet.ciiva.com/1962/cd00167470-1962473.pdf?src-supplier=Digi-Key; ComponentLink5URL: https://datasheet.ciiva.com/1962/cd00167470-1962474.pdf?src-supplier=Digi-Key; ComponentLink5Description: https://datasheet.ciiva.com/1962/cd00167470-1962474.pdf?src-supplier=Digi-Key; ComponentLink6URL: https://datasheet.ciiva.com/16491/cd00167470-16491245.pdf?src-supplier=Future+Electronics; ComponentLink6Description: https://datasheet.ciiva.com/16491/cd00167470-16491245.pdf?src-supplier=Future+Electronics
U16 = L78L08ABUTR: STMICROELECTRONICS         L78L08ABUTR             Fixed Linear Voltage Regulator, 7808, 3-Terminal, Positive, 14V To 30V In, 8V And 0.1A Out, SOT-89-3; Dropout Voltage: 1.7V; Number of Outputs: 1; Output Current: 100mA; Min Input Voltage: 10V; Min Supply Voltage: 10.5V; Quiescent Current: 6mA; Power Supply Rejection Ratio (PSRR): 45dB; Supplier 1: Mouser; Supplier Part Number 1: 511-L78L08ABU; Manufacturer: STMicroelectronics; Manufacturer Part Number: L78L08ABUTR; RoHS: Yes; Category: Voltage Regulators - Linear; Stock 1: 5535; Pricing 1: 1=0.44000, 10=0.35400, 100=0.21200, 1000=0.15600, 2500=0.13600, 10000=0.12900 (USD); Mount: Surface Mount; Case/Package: SOT-89; Number of Pins: 3; Weight: 0.004603oz; Min Operating Temperature: -40°C; Max Operating Temperature: 125°C; Packaging: Tape and Reel; Output Voltage: 8V; Package Quantity: 1; Max Output Current: 100mA; Max Input Voltage: 30V; Max Supply Voltage: 30V; Nominal Output Voltage: 8V; Number of Regulators: 1; Polarity: Positive; Min Output Voltage: 8V; Max Output Voltage: 8V; Termination: SMD/SMT; Output Type: Fixed; Length: 4.6mm; Height: 1.6mm; Width: 2.6mm; Radiation Hardening: No; REACH SVHC: No SVHC; Lead Free: Lead Free; ComponentLink1URL: https://datasheet.ciiva.com/2042/cd00000446-2042016.pdf?src-supplier=Digi-Key; ComponentLink1Description: https://datasheet.ciiva.com/2042/cd00000446-2042016.pdf?src-supplier=Digi-Key; ComponentLink2URL: https://datasheet.ciiva.com/2042/cd00000446-2042017.pdf?src-supplier=Digi-Key; ComponentLink2Description: https://datasheet.ciiva.com/2042/cd00000446-2042017.pdf?src-supplier=Digi-Key; ComponentLink3URL: https://datasheet.ciiva.com/3224/cd00000446-3224981.pdf?src-supplier=Avnet; ComponentLink3Description: https://datasheet.ciiva.com/3224/cd00000446-3224981.pdf?src-supplier=Avnet; ComponentLink4URL: https://datasheet.ciiva.com/1511/1868798-1511944.pdf?src-supplier=Element14; ComponentLink4Description: https://datasheet.ciiva.com/1511/1868798-1511944.pdf?src-supplier=Element14; ComponentLink5URL: https://datasheet.ciiva.com/22710/1897877-22710941.pdf?src-supplier=Element14; ComponentLink5Description: https://datasheet.ciiva.com/22710/1897877-22710941.pdf?src-supplier=Element14; ComponentLink6URL: https://datasheet.ciiva.com/16393/cd00000446-16393710.pdf?src-supplier=Future+Electronics; ComponentLink6Description: https://datasheet.ciiva.com/16393/cd00000446-16393710.pdf?src-supplier=Future+Electronics; ComponentLink7URL: https://datasheet.ciiva.com/2042/cd00000446-2042015.pdf?src-supplier=Digi-Key; ComponentLink7Description: https://datasheet.ciiva.com/2042/cd00000446-2042015.pdf?src-supplier=Digi-Key; ComponentLink8URL: https://datasheet.ciiva.com/41439/001184636-da-01-en-ic-reg-ldo-8v-0-l78l08abutr-sot-89-3-stm-41439739.pdf?src-supplier=Conrad; ComponentLink8Description: https://datasheet.ciiva.com/41439/001184636-da-01-en-ic-reg-ldo-8v-0-l78l08abutr-sot-89-3-stm-41439739.pdf?src-supplier=Conrad